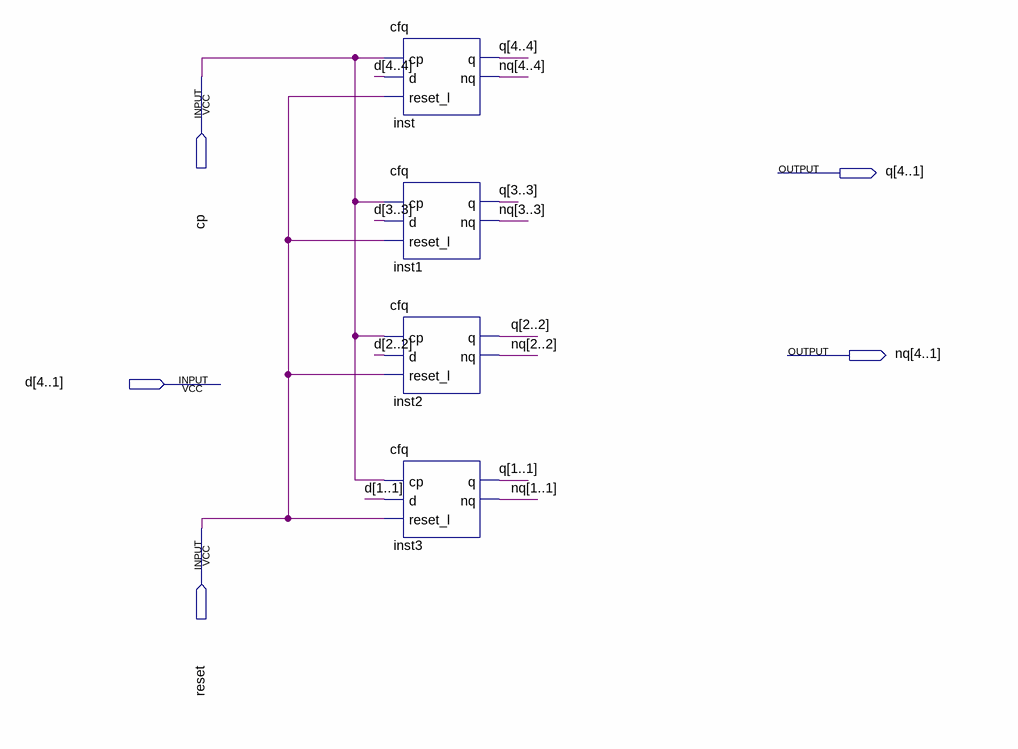
[diagram p0: schematic sheet]
// Quartus schematic jcq.bdf as structural Verilog: 4 symbols, 5 pins
module jcq (
  input  cp,
  input  [4:1] d,
  input  reset,
  output [4:1] q,
  output [4:1] nq
);

  cfq inst (.cp(cp), .d(d[4]), .reset_l(reset), .nq(nq[4]), .q(q[4]));
  cfq inst1 (.cp(cp), .d(d[3]), .reset_l(reset), .nq(nq[3]), .q(q[3]));
  cfq inst2 (.cp(cp), .d(d[2]), .reset_l(reset), .nq(nq[2]), .q(q[2]));
  cfq inst3 (.cp(cp), .d(d[1]), .reset_l(reset), .nq(nq[1]), .q(q[1]));
endmodule
